# Altium project A5000_8MB.PrjPcb
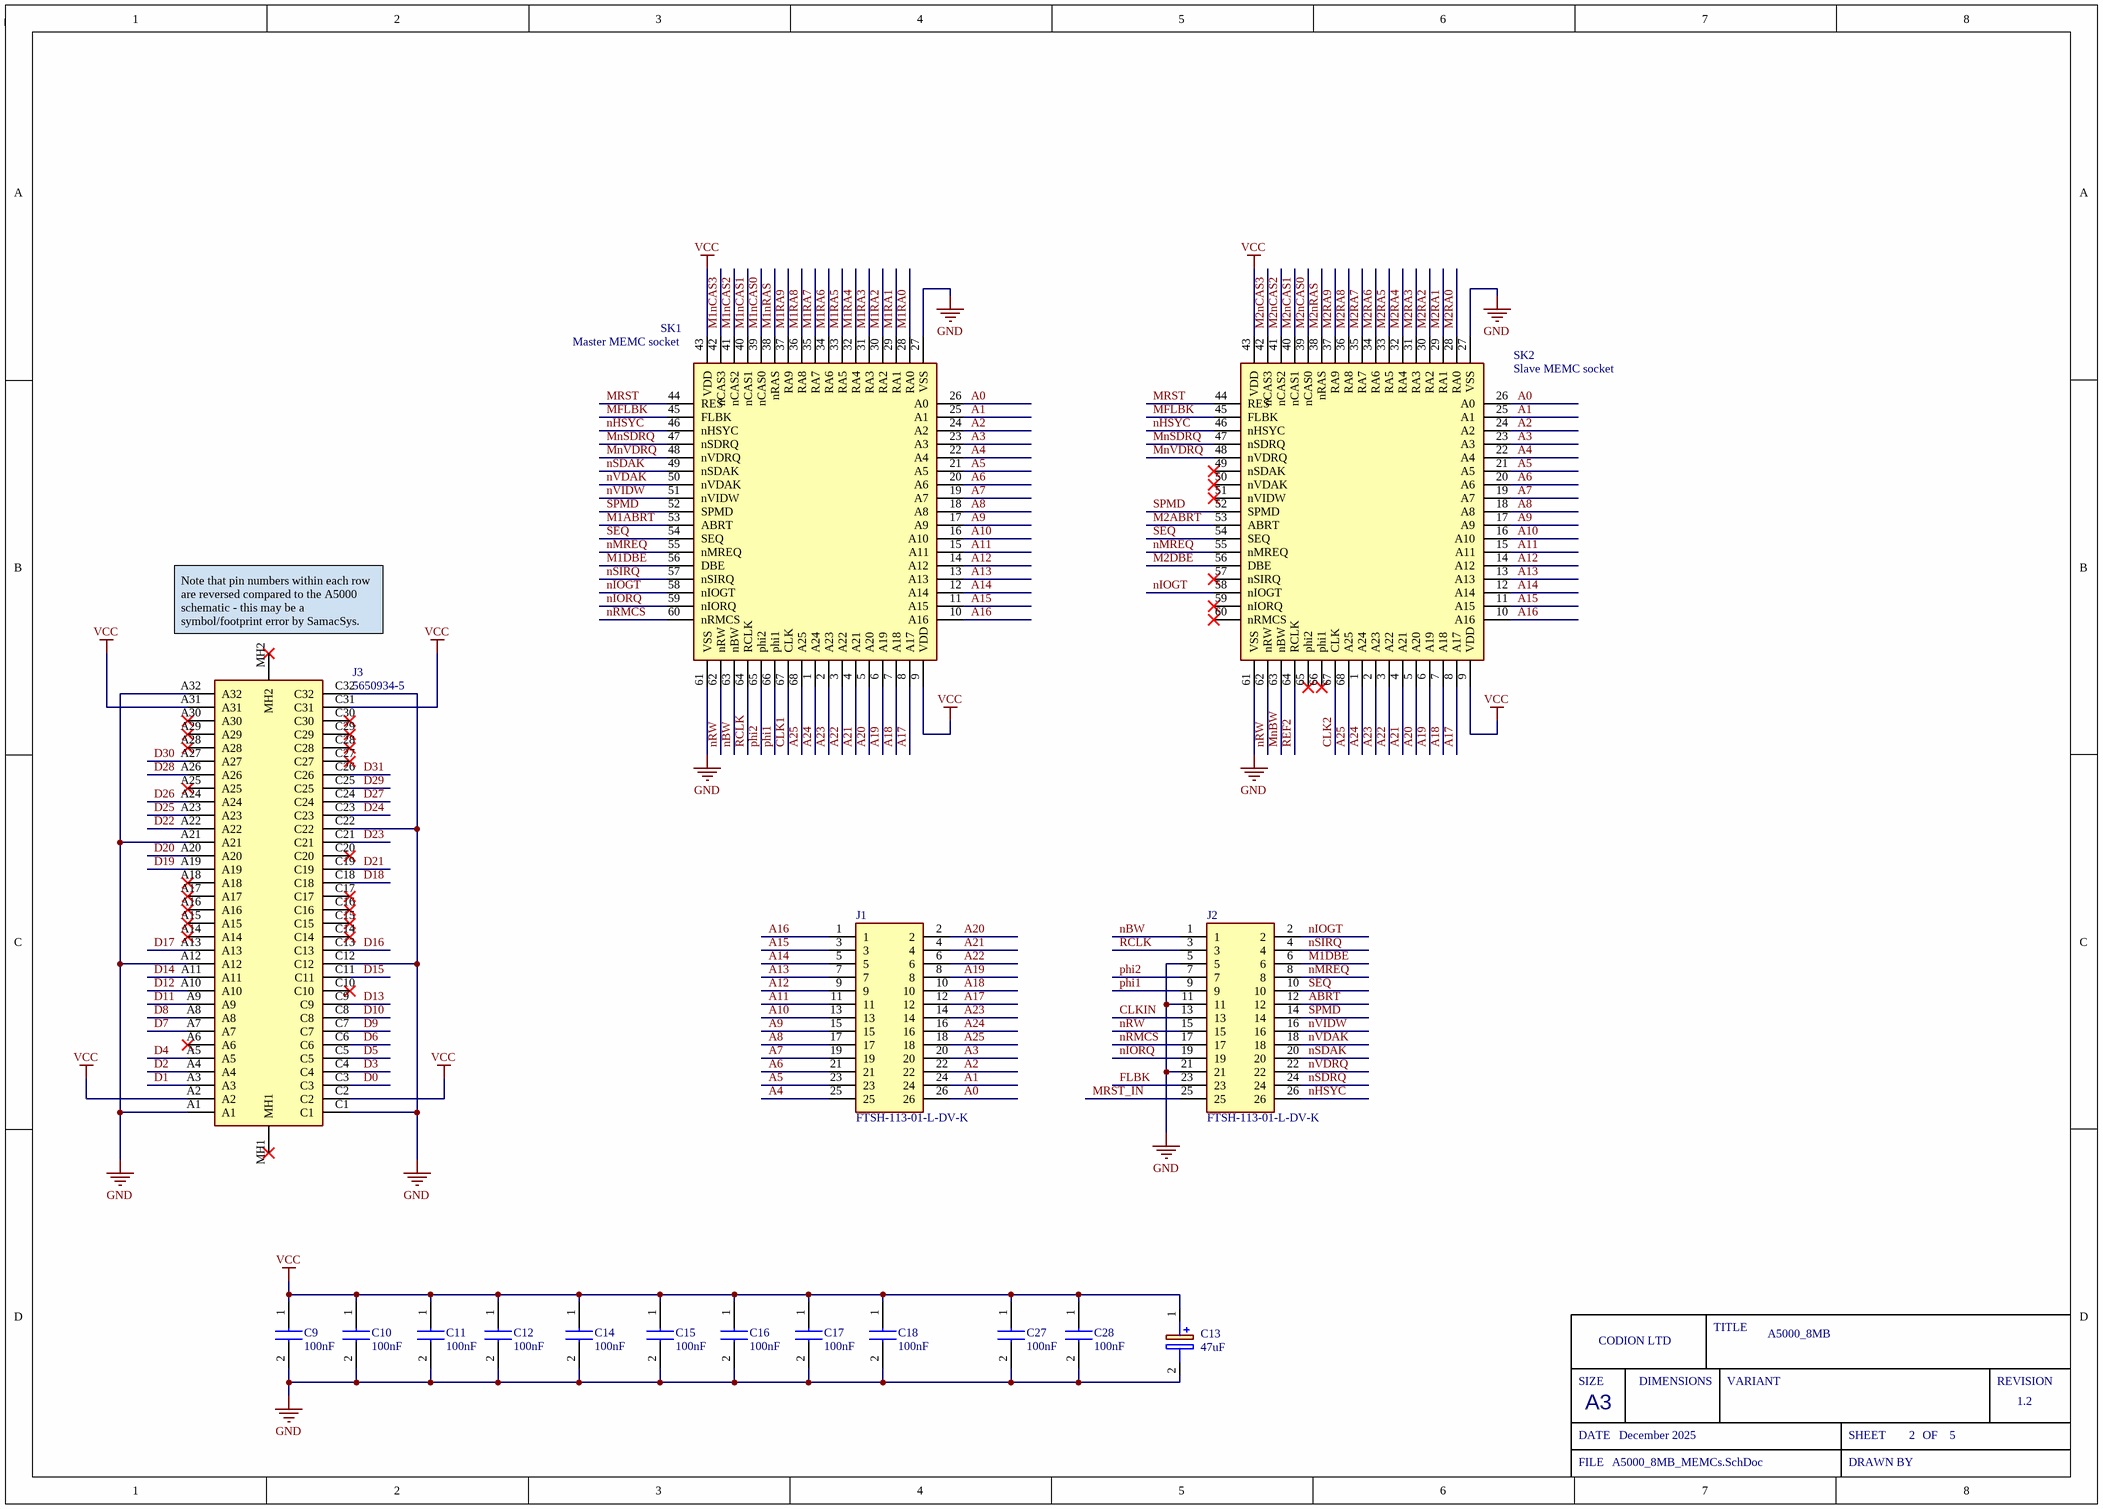
[diagram p0: A5000_8MB_MEMCs.SchDoc]
Sch_RevNo: 1.2; Sch_releaseDate: December 2025; Project_Title: A5000_8MB; ProjectName: A5000_8MB; PCB_RevNo: 1.2; Engineer_Name: Codion Ltd; BOM_RevNo: 1.2
3 sheets, 71 parts. Net scope: global (net labels, ports and power ports of the same name join across sheets).
Board file: A5000_8MB.pcbdoc
Sheets:
  A5000_8MB_MEMCs.SchDoc
  A5000_8MB_Glue.SchDoc
  A5000_8MB_RAMs.SchDoc

## Sheet A5000_8MB_MEMCs.SchDoc: ARM2 to ARM3 Adapter
size A3; DocumentNumber: 1; SheetNumber: 2; SheetTotal: 5

### Parts
C9  100nF  [0805cap]
C10  100nF  [0805cap]
C11  100nF  [0805cap]
C12  100nF  [0805cap]
C13  47uF  [EEE1AA101SP]
C14  100nF  [0805cap]
C15  100nF  [0805cap]
C16  100nF  [0805cap]
C17  100nF  [0805cap]
C18  100nF  [0805cap]
C27  100nF  [0805cap]
C28  100nF  [0805cap]
J1  FTSH-113-01-L-DV-K  [FTSH-113-XX-YYY-DV-K]
J2  FTSH-113-01-L-DV-K  [FTSH-113-XX-YYY-DV-K]
J3  5650934-5  [56509345]
SK1  Master MEMC socket  [MEMC_Socket]
SK2  Slave MEMC socket  [MEMC_Socket]

### Nets
GND: C9.2 C10.2 C11.2 C12.2 C13.2(-) C14.2 C15.2 C16.2 C17.2 C18.2 C27.2 C28.2 J2.5 J2.11 J2.21 J3.A1 J3.A12 J3.A21 J3.A32 J3.C1 J3.C12 J3.C22 J3.C32 SK1.27(VSS) SK1.61(VSS) SK2.27(VSS) SK2.61(VSS)
VCC: C9.1 C10.1 C11.1 C12.1 C13.1(+) C14.1 C15.1 C16.1 C17.1 C18.1 C27.1 C28.1 J3.A2 J3.A31 J3.C2 J3.C31 SK1.9(VDD) SK1.43(VDD) SK2.9(VDD) SK2.43(VDD)
A0: J1.26 SK1.26(A0) SK2.26(A0)
A1: J1.24 SK1.25(A1) SK2.25(A1)
A2: J1.22 SK1.24(A2) SK2.24(A2)
A3: J1.20 SK1.23(A3) SK2.23(A3)
A4: J1.25 SK1.22(A4) SK2.22(A4)
A5: J1.23 SK1.21(A5) SK2.21(A5)
A6: J1.21 SK1.20(A6) SK2.20(A6)
A7: J1.19 SK1.19(A7) SK2.19(A7)
A8: J1.17 SK1.18(A8) SK2.18(A8)
A9: J1.15 SK1.17(A9) SK2.17(A9)
A10: J1.13 SK1.16(A10) SK2.16(A10)
A11: J1.11 SK1.15(A11) SK2.15(A11)
A12: J1.9 SK1.14(A12) SK2.14(A12)
A13: J1.7 SK1.13(A13) SK2.13(A13)
A14: J1.5 SK1.12(A14) SK2.12(A14)
A15: J1.3 SK1.11(A15) SK2.11(A15)
A16: J1.1 SK1.10(A16) SK2.10(A16)
A17: J1.12 SK1.8(A17) SK2.8(A17)
A18: J1.10 SK1.7(A18) SK2.7(A18)
A19: J1.8 SK1.6(A19) SK2.6(A19)
A20: J1.2 SK1.5(A20) SK2.5(A20)
A21: J1.4 SK1.4(A21) SK2.4(A21)
A22: J1.6 SK1.3(A22) SK2.3(A22)
A23: J1.14 SK1.2(A23) SK2.2(A23)
A24: J1.16 SK1.1(A24) SK2.1(A24)
A25: J1.18 SK1.68(A25) SK2.68(A25)
ABRT: J2.12
CLK1: SK1.67(CLK)
CLK2: SK2.67(CLK)
CLKIN: J2.13
D0: J3.C3
D1: J3.A3
D2: J3.A4
D3: J3.C4
D4: J3.A5
D5: J3.C5
D6: J3.C6
D7: J3.A7
D8: J3.A8
D9: J3.C7
D10: J3.C8
D11: J3.A9
D12: J3.A10
D13: J3.C9
D14: J3.A11
D15: J3.C11
D16: J3.C13
D17: J3.A13
D18: J3.C18
D19: J3.A19
D20: J3.A20
D21: J3.C19
D22: J3.A22
D23: J3.C21
D24: J3.C23
D25: J3.A23
D26: J3.A24
D27: J3.C24
D28: J3.A26
D29: J3.C25
D30: J3.A27
D31: J3.C26
FLBK: J2.23
M1ABRT: SK1.53(ABRT)
M1DBE: J2.6 SK1.56(DBE)
M1nCAS0: SK1.39(nCAS0)
M1nCAS1: SK1.40(nCAS1)
M1nCAS2: SK1.41(nCAS2)
M1nCAS3: SK1.42(nCAS3)
M1nRAS: SK1.38(nRAS)
M1RA0: SK1.28(RA0)
M1RA1: SK1.29(RA1)
M1RA2: SK1.30(RA2)
M1RA3: SK1.31(RA3)
M1RA4: SK1.32(RA4)
M1RA5: SK1.33(RA5)
M1RA6: SK1.34(RA6)
M1RA7: SK1.35(RA7)
M1RA8: SK1.36(RA8)
M1RA9: SK1.37(RA9)
M2ABRT: SK2.53(ABRT)
M2DBE: SK2.56(DBE)
M2nCAS0: SK2.39(nCAS0)
M2nCAS1: SK2.40(nCAS1)
M2nCAS2: SK2.41(nCAS2)
M2nCAS3: SK2.42(nCAS3)
M2nRAS: SK2.38(nRAS)
M2RA0: SK2.28(RA0)
M2RA1: SK2.29(RA1)
M2RA2: SK2.30(RA2)
M2RA3: SK2.31(RA3)
M2RA4: SK2.32(RA4)
M2RA5: SK2.33(RA5)
M2RA6: SK2.34(RA6)
M2RA7: SK2.35(RA7)
M2RA8: SK2.36(RA8)
M2RA9: SK2.37(RA9)
MFLBK: SK1.45(FLBK) SK2.45(FLBK)
MnBW: SK2.63(nBW)
MnSDRQ: SK1.47(nSDRQ) SK2.47(nSDRQ)
MnVDRQ: SK1.48(nVDRQ) SK2.48(nVDRQ)
MRST: SK1.44(RES) SK2.44(RES)
MRST_IN: J2.25
nBW: J2.1 SK1.63(nBW)
nHSYC: J2.26 SK1.46(nHSYC) SK2.46(nHSYC)
nIOGT: J2.2 SK1.58(nIOGT) SK2.58(nIOGT)
nIORQ: J2.19 SK1.59(nIORQ)
nMREQ: J2.8 SK1.55(nMREQ) SK2.55(nMREQ)
nRMCS: J2.17 SK1.60(nRMCS)
nRW: J2.15 SK1.62(nRW) SK2.62(nRW)
nSDAK: J2.20 SK1.49(nSDAK)
nSDRQ: J2.24
nSIRQ: J2.4 SK1.57(nSIRQ)
nVDAK: J2.18 SK1.50(nVDAK)
nVDRQ: J2.22
nVIDW: J2.16 SK1.51(nVIDW)
phi1: J2.9 SK1.66(phi1)
phi2: J2.7 SK1.65(phi2)
RCLK: J2.3 SK1.64(RCLK)
REF2: SK2.64(RCLK)
SEQ: J2.10 SK1.54(SEQ) SK2.54(SEQ)
SPMD: J2.14 SK1.52(SPMD) SK2.52(SPMD)

Not connected (* = marked no-connect by the designer): J3 A6* A14* A15* A16* A17* A18* A25* A28* A29* A30* C10* C14* C15* C16* C17* C20* C27* C28* C29* C30* MH1* MH2*; SK2 49(nSDAK)* 50(nVDAK)* 51(nVIDW)* 57(nSIRQ)* 59(nIORQ)* 60(nRMCS)* 65(phi2)* 66(phi1)*

### Notes on the sheet
- (near J3) Note that pin numbers within each row are reversed compared to the A5000 schematic - this may be a symbol/footprint error by SamacSys.
- SIZE
- CODION LTD
- DIMENSIONS
- TITLE
- VARIANT
- REVISION
- DATE
- A3
- SHEET
- OF
- FILE
- DRAWN BY

### Library data of the parts
C9-C12 C14-C18 C27 C28 = 100nF0805: Capacitor; Manufacturer_Name: TDK; Manufacturer_Part_Number: C2012X7R1H104K125AM; Datasheet Link: https://product.tdk.com/info/en/catalog/datasheets/mlcc_commercial_midvoltage_en.pdf; Height: 1.45mm; Mouser Part Number: 810-C2012X7R1H104KT5; Mouser Price/Stock: https://www.mouser.com/Search/Refine.aspx?Keyword=810-C2012X7R1H104KT5; Arrow Part Number: C2012X7R1H104K125AM; Arrow Price/Stock: https://www.arrow.com/en/products/c2012x7r1h104k125am/tdk; LCSC Part #: C111492
C13 = EEE1VA470WP: Capacitor Polarised; Manufacturer_Name: Panasonic; Datasheet Link: http://industrial.panasonic.com/cdbs/www-data/pdf/RDE0000/ABA0000C1145.pdf; Height: 7.8mm; Manufacturer_Part_Number: EEE1VA470WP
J1 J2 = FTSH-113-01-L-DV-K: Connector; Manufacturer_Name: SAMTEC; Datasheet Link: http://suddendocs.samtec.com/prints/ftsh-1xx-xx-xxx-dv-xxx-xxx-mkt.pdf; Manufacturer_Part_Number: FTSH-113-01-L-DV-K; Mouser Part Number: 200-FTSH11301LDVK; Mouser Price/Stock: https://www.mouser.co.uk/ProductDetail/Samtec/FTSH-113-01-L-DV-K?qs=iT52DjcXudtZOdiFTGniSQ%3D%3D; Arrow Part Number: FTSH-113-01-L-DV-K; Arrow Price/Stock: https://www.arrow.com/en/products/ftsh-113-01-l-dv-k/samtec
J3 = 5650934-5: Connector; Manufacturer_Name: TE Connectivity; Datasheet Link: https://datasheet.datasheetarchive.com/originals/distributors/Datasheets_SAMA/9abbe19037fbf7301e49f31c79c0c77d.pdf; Height: 11.51mm; Manufacturer_Part_Number: 5650934-5; Mouser Part Number: 571-5650934-5; Mouser Price/Stock: https://www.mouser.co.uk/ProductDetail/TE-Connectivity/5650934-5?qs=DpCaYn0bdggz0Lybp365wg%3D%3D; Arrow Part Number: 5650934-5; Arrow Price/Stock: https://www.arrow.com/en/products/5650934-5/te-connectivity
SK1 SK2 = MEMC_Skt: MEMC socket; Manufacturer_Name: 3M; Manufacturer_Part_Number: 8468-21B1-RK-TR; Datasheet Link: https://www.arrow.com/en/products/8468-21b1-rk-tr/3m; Height: 4.6mm; Mouser Part Number: 517-8468-21B1-RK-TR; Mouser Price/Stock: https://www.mouser.co.uk/ProductDetail/3M-Electronic-Solutions-Division/8468-21B1-RK-TR?qs=X%2F%2F06fXhnJ18zOj3KK47CQ%3D%3D; Arrow Part Number: 8468-21B1-RK-TR; Arrow Price/Stock: https://www.arrow.com/en/products/8468-21b1-rk-tr/3m

## Sheet A5000_8MB_Glue.SchDoc
size A3; DocumentNumber: 1; SheetNumber: 1; SheetTotal: 5
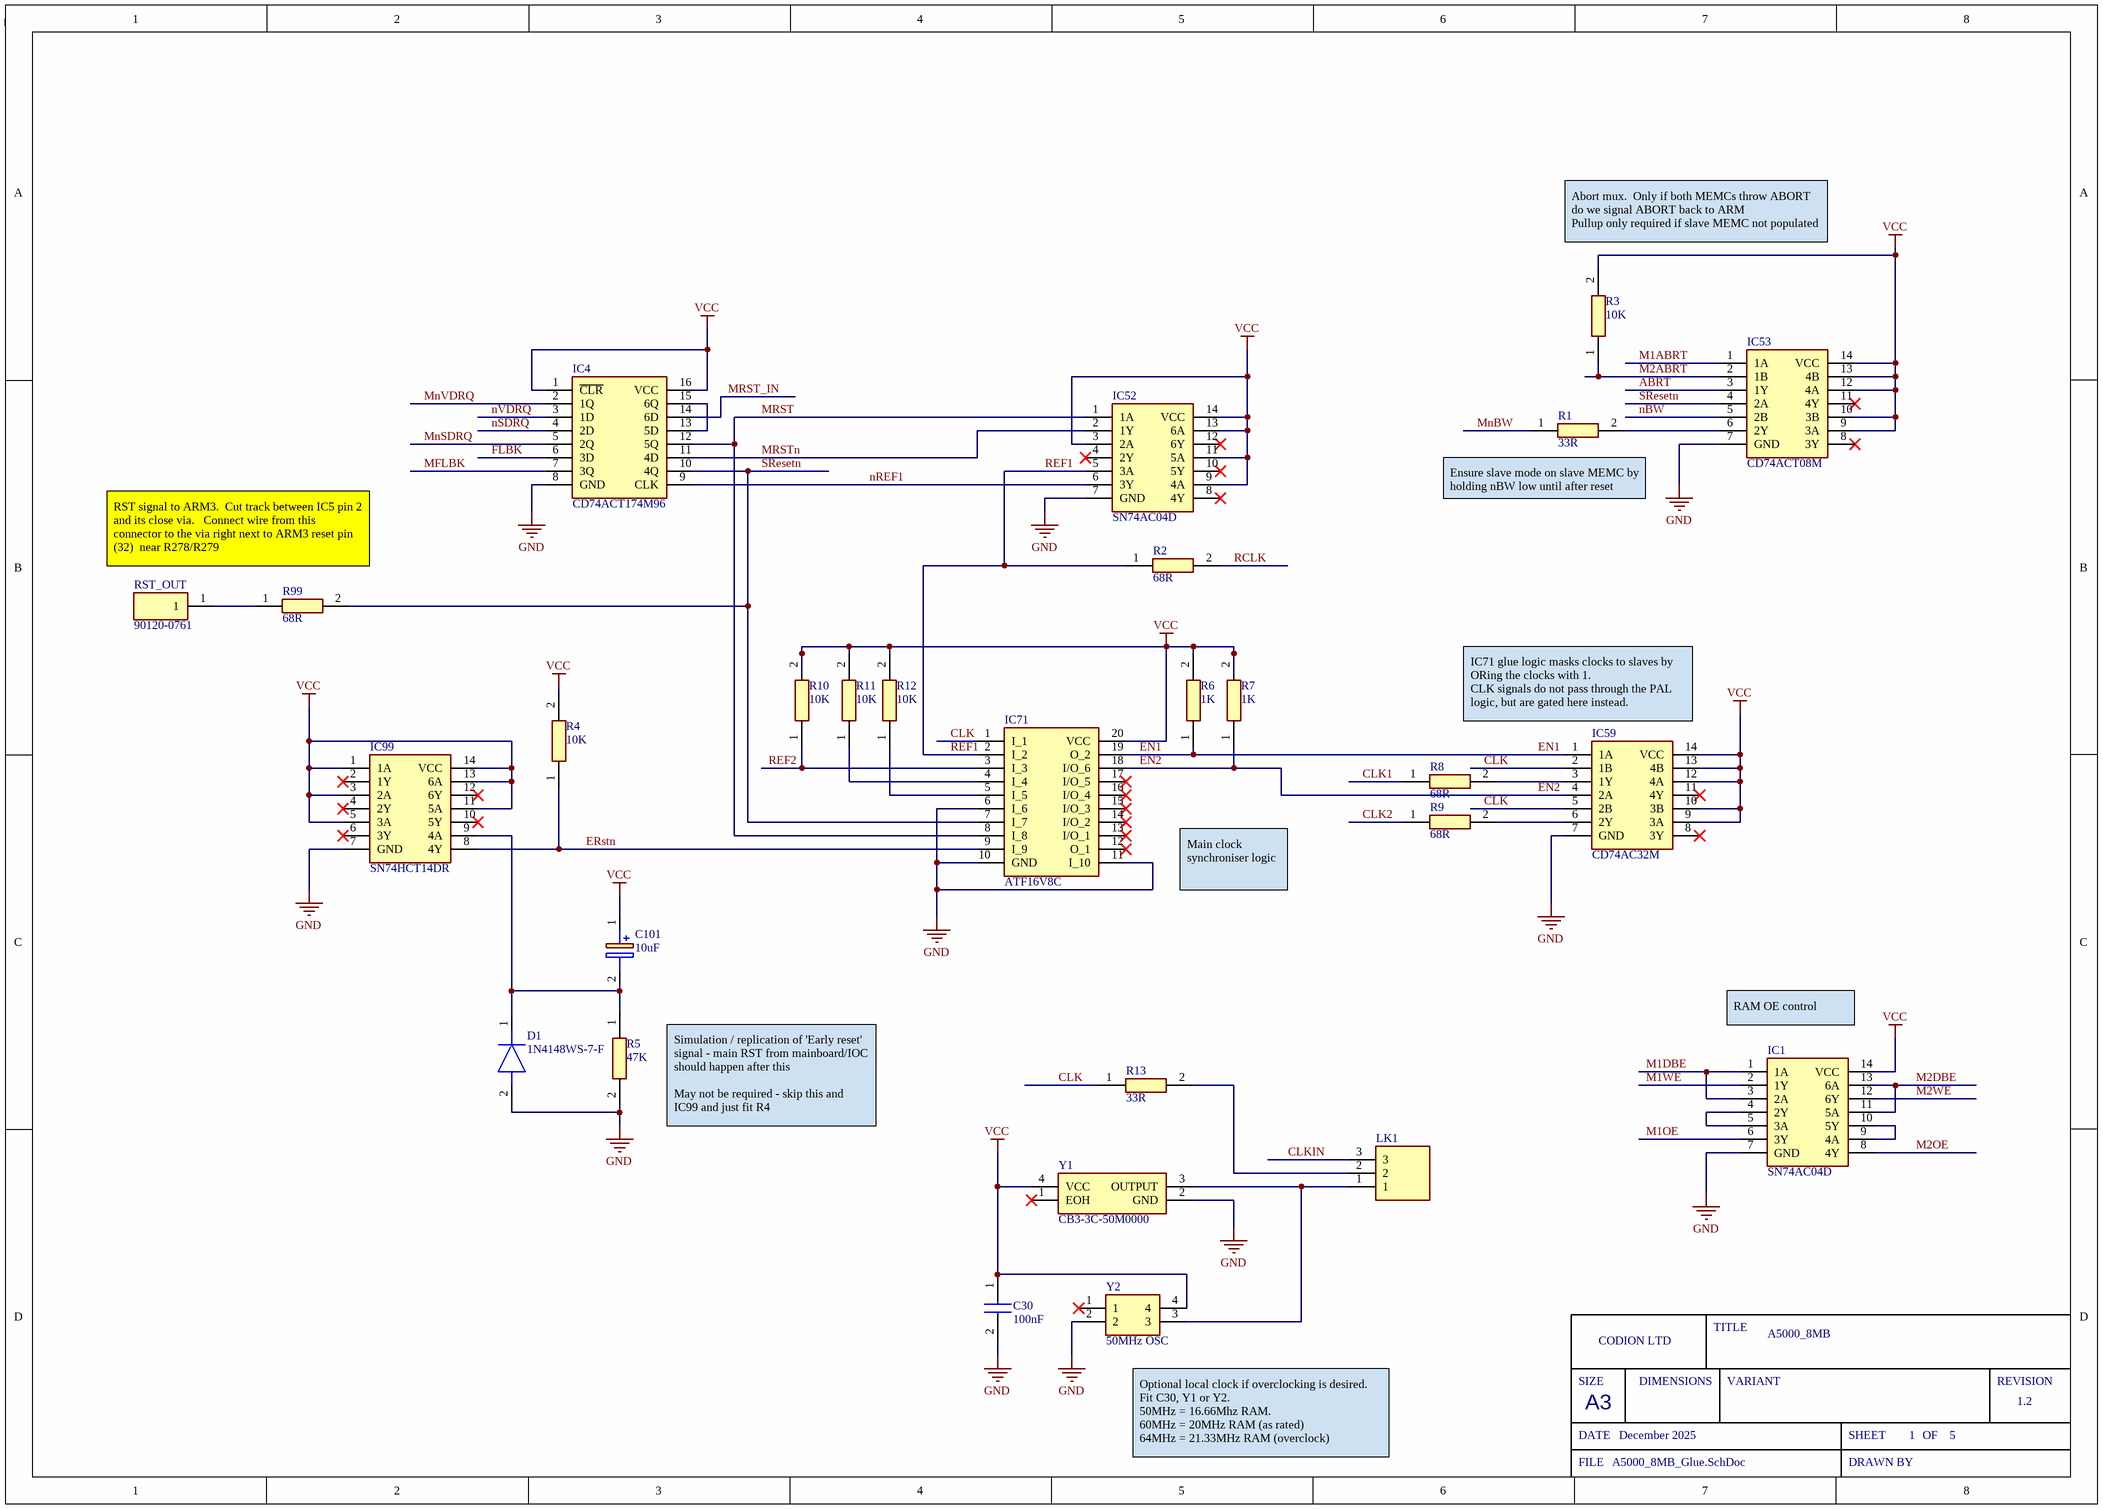
[diagram p1: A5000_8MB_Glue.SchDoc]

### Parts
C30  100nF  [0805cap]
C101  10uF  [EEE0GA101SR]
D1  1N4148WS-7-F  [SOD2513X120N]
IC1  SN74AC04D  [SOIC127P600X175-14N]
IC4  CD74ACT174M96  [SOIC127P600X175-16N]
IC52  SN74AC04D  [SOIC127P600X175-14N]
IC53  CD74ACT08M  [SOIC127P600X175-14N]
IC59  CD74AC32M  [SOIC127P600X175-14N]
IC71  ATF16V8C  [DIP762W66P254L2692H508Q20N]
IC99  SN74HCT14DR  [SOIC127P600X175-14N]
LK1  PREC003SAAN-RC  [HDRV3W64P0X254_1X3_762X254X868P]  (value not drawn)
R1  33R  [RESC1005X40N]
R2  68R  [RESC1005X40N]
R3  10K  [RESC1005X40N]
R4  10K  [RESC1005X40N]
R5  47K  [RESC1005X40N]
R6  1K  [RESC1005X40N]
R7  1K  [RESC1005X40N]
R8  68R  [RESC1005X40N]
R9  68R  [RESC1005X40N]
R10  10K  [RESC1005X40N]
R11  10K  [RESC1005X40N]
R12  10K  [RESC1005X40N]
R13  33R  [RESC1005X40N]
R99  68R  [RESC1005X40N]
RST_OUT  90120-0761  [HDRV1W90P0X254_1X1_232X249X560P]
Y1  CB3-3C-50M0000  [CB33C50M0000]
Y2  50MHz OSC  [DIPS762W56P1524L1778H241Q4N]

### Nets
GND: C30.2 D1.2(A) IC1.7(GND) IC4.8(GND) IC52.7(GND) IC53.7(GND) IC59.7(GND) IC71.6(I_6) IC71.10(GND) IC71.11(I_10) IC99.7(GND) R5.2 Y1.2(GND) Y2.2
VCC: C30.1 C101.1(+) IC1.14(VCC) IC4.1(~{CLR}) IC4.16(VCC) IC52.3(2A) IC52.9(4A) IC52.11(5A) IC52.13(6A) IC52.14(VCC) IC53.9(3A) IC53.10(3B) IC53.12(4A) IC53.13(4B) IC53.14(VCC) IC59.9(3A) IC59.10(3B) IC59.12(4A) IC59.13(4B) IC59.14(VCC) IC71.20(VCC) IC99.1(1A) IC99.3(2A) IC99.5(3A) IC99.11(5A) IC99.13(6A) IC99.14(VCC) R3.2 R4.2 R6.2 R7.2 R10.2 R11.2 R12.2 Y1.4(VCC) Y2.4
ABRT: IC53.3(1Y)
CLK: IC59.2(1B) IC59.5(2B) IC71.1(I_1) R13.1
CLK1: R8.1
CLK2: R9.1
CLKIN: LK1.3
EN1: IC59.1(1A) IC71.19(O_2) R6.1
EN2: IC59.4(2A) IC71.18(I/O_6) R7.1
ERstn: IC71.9(I_9) IC99.8(4Y) R4.1
FLBK: IC4.6(3D)
M1ABRT: IC53.1(1A)
M1DBE: IC1.1(1A) IC1.3(2A)
M1OE: IC1.6(3Y)
M1WE: IC1.2(1Y)
M2ABRT: IC53.2(1B) R3.1
M2DBE: IC1.11(5A) IC1.13(6A)
M2OE: IC1.8(4Y)
M2WE: IC1.12(6Y)
MFLBK: IC4.7(3Q)
MnBW: R1.1
MnSDRQ: IC4.5(2Q)
MnVDRQ: IC4.2(1Q)
MRST: IC4.12(5Q) IC52.1(1A) IC71.8(I_8)
MRST_IN: IC4.14(6D)
MRSTn: IC4.11(4D) IC52.2(1Y)
nBW: IC53.5(2B)
nREF1: IC4.9(CLK) IC52.6(3Y)
nSDRQ: IC4.4(2D)
nVDRQ: IC4.3(1D)
RCLK: R2.2
REF1: IC52.5(3A) IC71.2(I_2) R2.1
REF2: IC71.3(I_3) R10.1
SResetn: IC4.10(4Q) IC53.4(2A) IC71.7(I_7) R99.2
NetC101_2: C101.2(-) D1.1(K) IC99.9(4A) R5.1
NetIC1_4: IC1.4(2Y) IC1.5(3A)
NetIC1_9: IC1.9(4A) IC1.10(5Y)
NetIC4_13: IC4.13(5D) IC4.15(6Q)
NetIC53_6: IC53.6(2Y) R1.2
NetIC59_3: IC59.3(1Y) R8.2
NetIC59_6: IC59.6(2Y) R9.2
NetIC71_4: IC71.4(I_4) R11.1
NetIC71_5: IC71.5(I_5) R12.1
NetLK1_1: LK1.1 Y1.3(OUTPUT) Y2.3
NetLK1_2: LK1.2 R13.2
NetR99_1: R99.1 RST_OUT.1

Not connected (* = marked no-connect by the designer): IC52 4(2Y)* 8(4Y)* 10(5Y)* 12(6Y)*; IC53 8(3Y)* 11(4Y)*; IC59 8(3Y)* 11(4Y)*; IC71 12(O_1)* 13(I/O_1)* 14(I/O_2)* 15(I/O_3)* 16(I/O_4)* 17(I/O_5)*; IC99 2(1Y)* 4(2Y)* 6(3Y)* 10(5Y)* 12(6Y)*; Y1 1(EOH)*; Y2 1*

### Notes on the sheet
- Abort mux.  Only if both MEMCs throw ABORT do we signal ABORT back to ARM
  Pullup only required if slave MEMC not populated
- (near R1) Ensure slave mode on slave MEMC by holding nBW low until after reset
- RST signal to ARM3.  Cut track between IC5 pin 2 and its close via.   Connect wire from this connector to the via right next to ARM3 reset pin (32)  near R278/R279
- (near IC59) IC71 glue logic masks clocks to slaves by ORing the clocks with 1.
  CLK signals do not pass through the PAL logic, but are gated here instead.
- Main clock synchroniser logic
- (near IC1) RAM OE control
- Simulation / replication of 'Early reset' signal - main RST from mainboard/IOC should happen after this
  May not be required - skip this and IC99 and just fit R4
- (near Y2) Optional local clock if overclocking is desired.
  Fit C30, Y1 or Y2.
  50MHz = 16.66Mhz RAM.
  60MHz = 20MHz RAM (as rated)
  64MHz = 21.33MHz RAM (overclock)
- SIZE
- CODION LTD
- DIMENSIONS
- TITLE
- VARIANT
- REVISION
- DATE
- A3
- SHEET
- OF
- FILE
- DRAWN BY

### Library data of the parts
C30 = 100nF0805: as C9 on sheet A5000_8MB_MEMCs; Datasheet Link: https://product.tdk.com/info/en/catalog/datasheets/mlcc_commercial_midvoltage_en.pdf; Height: 1.45mm; Mouser Part Number: 810-C2012X7R1H104KT5; Mouser Price/Stock: https://www.mouser.com/Search/Refine.aspx?Keyword=810-C2012X7R1H104KT5; Arrow Part Number: C2012X7R1H104K125AM; Arrow Price/Stock: https://www.arrow.com/en/products/c2012x7r1h104k125am/tdk; LCSC Part #: C111492
C101 = EEE-1EA100SR: Capacitor Polarised; Manufacturer_Name: Panasonic; Datasheet Link: http://industrial.panasonic.com/cdbs/www-data/pdf/RDE0000/ABA0000C1145.pdf; Height: 6.5mm; Manufacturer_Part_Number: EEE-1EA100SR; Mouser Part Number: 667-EEE-1EA100SR; Mouser Price/Stock: https://www.mouser.co.uk/ProductDetail/Panasonic/EEE-1EA100SR?qs=ANJC8C65Mw4%2Fvo1GoepKcQ%3D%3D; Arrow Part Number: EEE-1EA100SR; Arrow Price/Stock: https://www.arrow.com/en/products/eee-1ea100sr/panasonic?region=nac
D1 = 1N4148WS-7-F: Diode; Manufacturer_Name: Diodes Inc.; Datasheet Link: https://componentsearchengine.com/Datasheets/2/1N4148WS-7-F.pdf; Height: 1.2mm; Manufacturer_Part_Number: 1N4148WS-7-F; Mouser Part Number: 621-1N4148WS-F; Mouser Price/Stock: https://www.mouser.co.uk/ProductDetail/Diodes-Incorporated/1N4148WS-7-F?qs=4drIV0IxA0r8aNy7%2Fu4kVw%3D%3D; Arrow Part Number: 1N4148WS-7-F; Arrow Price/Stock: https://www.arrow.com/en/products/1n4148ws-7-f/diodes-incorporated?region=asia; LCSC Part #: C2128
IC1 IC52 = SN74AC04D: Integrated Circuit; Manufacturer_Name: Texas Instruments; Datasheet Link: http://www.ti.com/lit/ds/symlink/sn74ac04.pdf; Height: 1.75mm; Manufacturer_Part_Number: SN74AC04D; Mouser Part Number: 595-SN74AC04D; Mouser Price/Stock: https://www.mouser.co.uk/ProductDetail/Texas-Instruments/SN74AC04D?qs=w32V8uFkMxkvsyMHHacuZw%3D%3D; Arrow Part Number: SN74AC04D; Arrow Price/Stock: https://www.arrow.com/en/products/sn74ac04d/texas-instruments?region=nac; LCSC Part #: C352940
IC4 = CD74ACT174M96: Integrated Circuit; Manufacturer_Name: Texas Instruments; Datasheet Link: http://www.ti.com/lit/gpn/cd74act174; Height: 1.75mm; Manufacturer_Part_Number: CD74ACT174M96; Mouser Part Number: 595-CD74ACT174M96; Mouser Price/Stock: https://www.mouser.co.uk/ProductDetail/Texas-Instruments/CD74ACT174M96?qs=w32V8uFkMxkDXs1ka6HDkg%3D%3D
IC53 = CD74ACT08M: Integrated Circuit; Manufacturer_Name: Texas Instruments; Datasheet Link: http://www.ti.com/lit/ds/symlink/cd74act08.pdf; Height: 1.75mm; Manufacturer_Part_Number: CD74ACT08M; Mouser Part Number: 595-CD74ACT08M; Mouser Price/Stock: https://www.mouser.co.uk/ProductDetail/Texas-Instruments/CD74ACT08M?qs=Dqy2GfToSoQdsNWXM2phYA%3D%3D; LCSC Part #: C233452
IC59 = CD74AC32M: Integrated Circuit; Manufacturer_Name: Texas Instruments; Datasheet Link: http://www.ti.com/lit/ds/symlink/cd74ac32.pdf; Height: 1.75mm; Manufacturer_Part_Number: CD74AC32M; Mouser Part Number: 595-CD74AC32M; Mouser Price/Stock: https://www.mouser.co.uk/ProductDetail/Texas-Instruments/CD74AC32M?qs=OorDGPQ79Eqsy7tzrsTtUg%3D%3D; Arrow Part Number: CD74AC32M; Arrow Price/Stock: https://www.arrow.com/en/products/cd74ac32m/texas-instruments; LCSC Part #: C352943
IC71 = PAL16R4AMJ: Integrated Circuit; Manufacturer_Name: Texas Instruments; Datasheet Link: http://www.ti.com/lit/ds/symlink/pal16r4am.pdf; Height: 5.08mm; Manufacturer_Part_Number: PAL16R4AMJ; Mouser Part Number: 595-PAL16R4AMJ; Mouser Price/Stock: https://www.mouser.com/Search/Refine.aspx?Keyword=595-PAL16R4AMJ
IC99 = SN74HCT14DR: Integrated Circuit; Manufacturer_Name: Texas Instruments; Datasheet Link: http://www.ti.com/lit/ds/symlink/sn74hct14.pdf; Height: 1.75mm; Manufacturer_Part_Number: SN74HCT14DR; Mouser Part Number: 595-SN74HCT14DR; Mouser Price/Stock: https://www.mouser.co.uk/ProductDetail/Texas-Instruments/SN74HCT14DR?qs=SL3LIuy2dWxogEVGE105Iw%3D%3D; Arrow Part Number: SN74HCT14DR; Arrow Price/Stock: https://www.arrow.com/en/products/sn74hct14dr/texas-instruments?region=nac; LCSC Part #: C6769
LK1 = PREC003SAAN-RC: Connector; Manufacturer_Name: Sullins; Datasheet Link: https://media.digikey.com/PDF/Data%20Sheets/Sullins%20PDFs/z%20RzCzzzSzzN-RC,%20ST,11635-B.pdf; Height: 8.68mm; Manufacturer_Part_Number: PREC003SAAN-RC
R1 R13 = CRCW040233R0FKED: Resistor; Manufacturer_Name: Vishay; Datasheet Link: http://www.vishay.com/docs/20035/dcrcwe3.pdf; Height: 0.4mm; Manufacturer_Part_Number: CRCW040233R0FKED; Mouser Part Number: 71-CRCW0402-33-E3; Mouser Price/Stock: https://www.mouser.co.uk/ProductDetail/Vishay-Dale/CRCW040233R0FKED?qs=TNtMkGKFKOyo77UGFlXIJw%3D%3D; Arrow Part Number: CRCW040233R0FKED; Arrow Price/Stock: https://www.arrow.com/en/products/crcw040233r0fked/vishay; LCSC Part #: C137880
R2 R8 R9 R99 = CRCW040268R0FKEDHP: Resistor; Manufacturer_Name: Vishay; Datasheet Link: http://www.vishay.com/docs/20035/dcrcwe3.pdf; Height: 0.4mm; Manufacturer_Part_Number: CRCW040268R0FKEDHP; Mouser Part Number: 71-CRCW040268R0FKEDH; Mouser Price/Stock: https://www.mouser.co.uk/ProductDetail/Vishay-Dale/CRCW040268R0FKEDHP?qs=YaA%252B3EhhSt26vU44iyW%252BOw%3D%3D; Arrow Part Number: CRCW040268R0FKEDHP; Arrow Price/Stock: https://www.arrow.com/en/products/crcw040268r0fkedhp/vishay; LCSC Part #: C163455
R3 R4 R10-R12 = CRCW040210K0FKEDHP: Resistor; Manufacturer_Name: Vishay; Datasheet Link: http://www.vishay.com/docs/20035/dcrcwe3.pdf; Height: 0.4mm; Manufacturer_Part_Number: CRCW040210K0FKEDHP; Mouser Part Number: 71-CRCW040210K0FKEDH; Mouser Price/Stock: https://www.mouser.co.uk/ProductDetail/Vishay-Dale/CRCW040210K0FKEDHP?qs=FlFvgi4rxBxmIiaeyFjrkA%3D%3D; Arrow Part Number: CRCW040210K0FKEDHP; Arrow Price/Stock: https://www.arrow.com/en/products/crcw040210k0fkedhp/vishay?region=nac; LCSC Part #: C71617
R5 = CRCW040247K0FKED: Resistor; Manufacturer_Name: Vishay; Datasheet Link: http://www.vishay.com/docs/20035/dcrcwe3.pdf; Height: 0.4mm; Manufacturer_Part_Number: CRCW040247K0FKED; Mouser Part Number: 71-CRCW0402-47K-E3; Mouser Price/Stock: https://www.mouser.co.uk/ProductDetail/Vishay-Dale/CRCW040247K0FKED?qs=rzhQWu8UUS0SPbmGf0DOIg%3D%3D; Arrow Part Number: CRCW040247K0FKED; Arrow Price/Stock: https://www.arrow.com/en/products/crcw040247k0fked/vishay; LCSC Part #: C163440
R6 R7 = CRCW04021K00JNED: Resistor; Manufacturer_Name: Vishay; Datasheet Link: http://www.vishay.com/docs/20035/dcrcwe3.pdf; Height: 0.4mm; Manufacturer_Part_Number: CRCW04021K00JNED; Mouser Part Number: 71-CRCW0402J-1.0K-E3; Mouser Price/Stock: https://www.mouser.co.uk/ProductDetail/Vishay-Dale/CRCW04021K00JNED?qs=YX%252BK5oaHNYpGRsHVuzxl1A%3D%3D; Arrow Part Number: CRCW04021K00JNED; Arrow Price/Stock: https://www.arrow.com/en/products/crcw04021k00jned/vishay; LCSC Part #: C279981
RST_OUT = 90120-0761: Connector; Manufacturer_Name: Molex; Datasheet Link: https://www.molex.com/pdm_docs/sd/901200761_sd.pdf; Height: 5.6mm; Manufacturer_Part_Number: 90120-0761; Mouser Part Number: 538-90120-0761; Mouser Price/Stock: https://www.mouser.co.uk/ProductDetail/Molex/90120-0761?qs=PvP5v7Eimsn%2F58TpDaAAow%3D%3D
Y1 = CB3-3C-50M0000: Crystal or Oscillator; Manufacturer_Name: CTS; Datasheet Link: https://www.arrow.com/en/products/cb3-3c-50m0000/cts; Height: 1.8mm; Manufacturer_Part_Number: CB3-3C-50M0000; Mouser Part Number: 774-CB3-3C-50M0; Mouser Price/Stock: https://www.mouser.co.uk/ProductDetail/CTS-Electronic-Components/CB3-3C-50M0000/?qs=HL%252BYNjdyZ0t9%2FwogPxCGyA%3D%3D; Arrow Part Number: CB3-3C-50M0000; Arrow Price/Stock: https://www.arrow.com/en/products/cb3-3c-50m0000/cts
Y2 = 1107741: Manufacturer_Name: ARIES; Datasheet Link: http://docs-emea.rs-online.com/webdocs/13f3/0900766b813f3237.pdf; Height: 2.41mm; Manufacturer_Part_Number: 1107741; Mouser Part Number: 535-1107741; Mouser Price/Stock: https://www.mouser.co.uk/ProductDetail/Aries-Electronics/1107741?qs=WZRMhwwaLl%2FApwqojhfzdA%3D%3D

## Sheet A5000_8MB_RAMs.SchDoc: ARM2 to ARM3 Adapter
size A3; DocumentNumber: 1; SheetNumber: 3; SheetTotal: 5
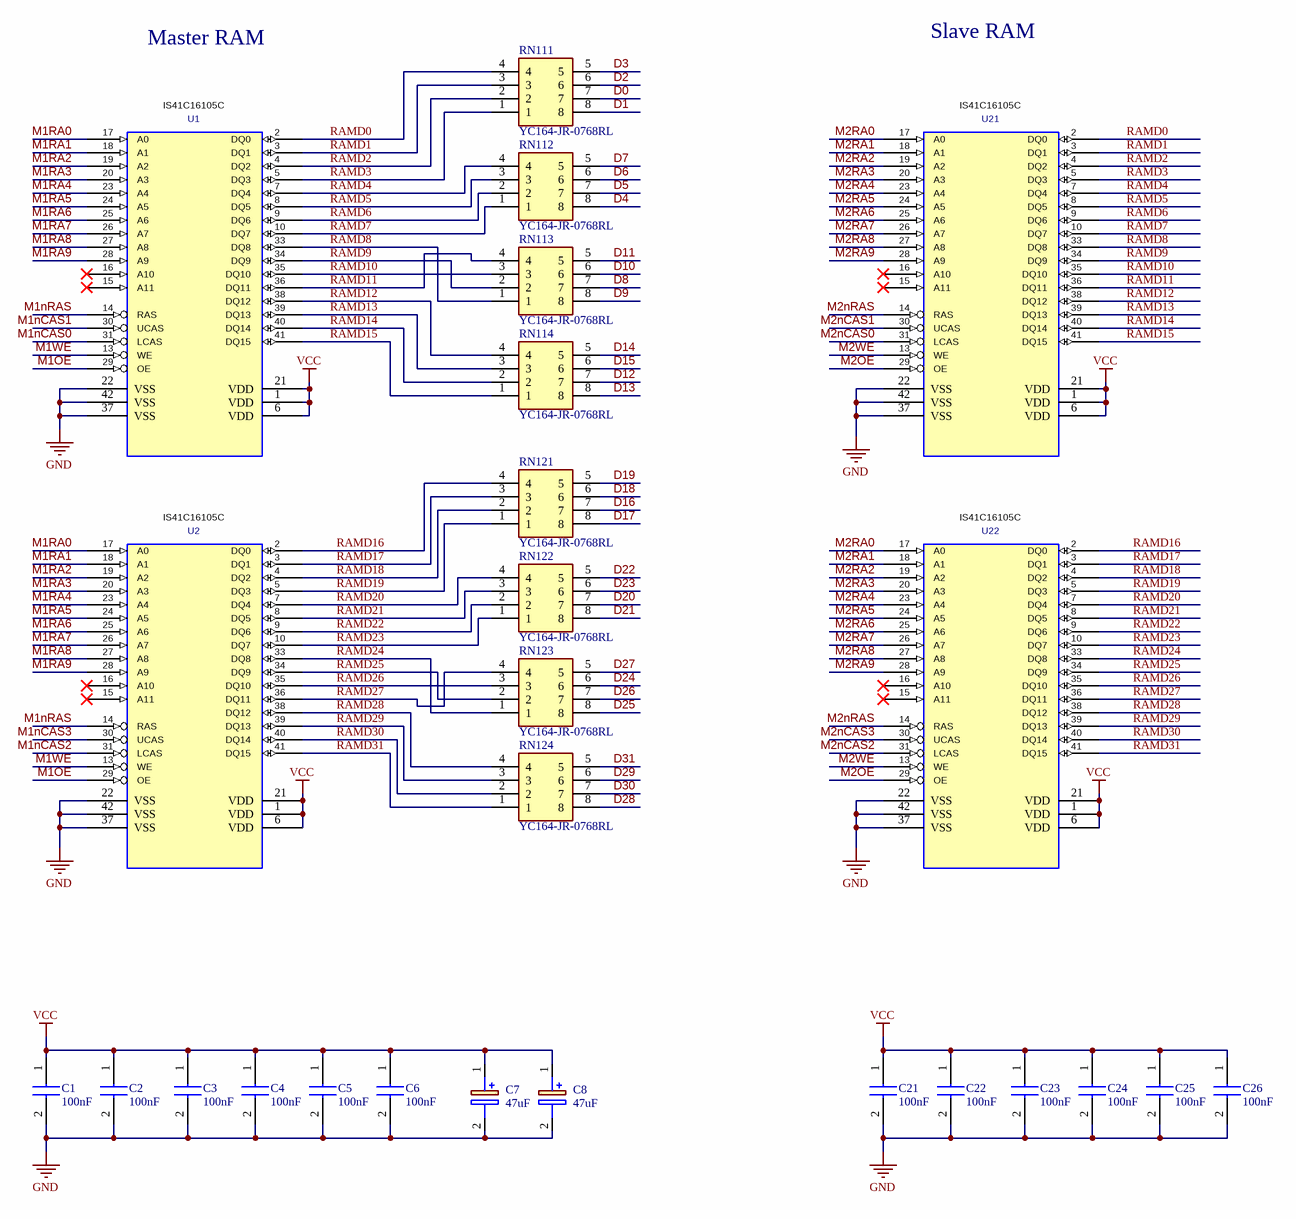
[diagram p2: A5000_8MB_RAMs.SchDoc]

### Parts
C1  100nF  [0805cap]
C2  100nF  [0805cap]
C3  100nF  [0805cap]
C4  100nF  [0805cap]
C5  100nF  [0805cap]
C6  100nF  [0805cap]
C7  47uF  [EEE1AA101SP]
C8  47uF  [EEE1AA101SP]
C21  100nF  [0805cap]
C22  100nF  [0805cap]
C23  100nF  [0805cap]
C24  100nF  [0805cap]
C25  100nF  [0805cap]
C26  100nF  [0805cap]
RN111  YC164-JR-0768RL  [YC164JR0768RL]
RN112  YC164-JR-0768RL  [YC164JR0768RL]
RN113  YC164-JR-0768RL  [YC164JR0768RL]
RN114  YC164-JR-0768RL  [YC164JR0768RL]
RN121  YC164-JR-0768RL  [YC164JR0768RL]
RN122  YC164-JR-0768RL  [YC164JR0768RL]
RN123  YC164-JR-0768RL  [YC164JR0768RL]
RN124  YC164-JR-0768RL  [YC164JR0768RL]
U1  IS41C16105C  [SOJ-42]
U2  IS41C16105C  [SOJ-42]
U21  IS41C16105C  [SOJ-42]
U22  IS41C16105C  [SOJ-42]

### Nets
GND: C1.2 C2.2 C3.2 C4.2 C5.2 C6.2 C7.2(-) C8.2(-) C21.2 C22.2 C23.2 C24.2 C25.2 C26.2 U1.22(VSS) U1.37(VSS) U1.42(VSS) U2.22(VSS) U2.37(VSS) U2.42(VSS) U21.22(VSS) U21.37(VSS) U21.42(VSS) U22.22(VSS) U22.37(VSS) U22.42(VSS)
VCC: C1.1 C2.1 C3.1 C4.1 C5.1 C6.1 C7.1(+) C8.1(+) C21.1 C22.1 C23.1 C24.1 C25.1 C26.1 U1.1(VCC) U1.6(VCC) U1.21(VCC) U2.1(VCC) U2.6(VCC) U2.21(VCC) U21.1(VCC) U21.6(VCC) U21.21(VCC) U22.1(VCC) U22.6(VCC) U22.21(VCC)
D0: RN111.7
D1: RN111.8
D2: RN111.6
D3: RN111.5
D4: RN112.8
D5: RN112.7
D6: RN112.6
D7: RN112.5
D8: RN113.7
D9: RN113.8
D10: RN113.6
D11: RN113.5
D12: RN114.7
D13: RN114.8
D14: RN114.5
D15: RN114.6
D16: RN121.7
D17: RN121.8
D18: RN121.6
D19: RN121.5
D20: RN122.7
D21: RN122.8
D22: RN122.5
D23: RN122.6
D24: RN123.6
D25: RN123.8
D26: RN123.7
D27: RN123.5
D28: RN124.8
D29: RN124.6
D30: RN124.7
D31: RN124.5
M1nCAS0: U1.31(LCAS)
M1nCAS1: U1.30(UCAS)
M1nCAS2: U2.31(LCAS)
M1nCAS3: U2.30(UCAS)
M1nRAS: U1.14(RAS) U2.14(RAS)
M1OE: U1.29(OE) U2.29(OE)
M1RA0: U1.17(A0) U2.17(A0)
M1RA1: U1.18(A1) U2.18(A1)
M1RA2: U1.19(A2) U2.19(A2)
M1RA3: U1.20(A3) U2.20(A3)
M1RA4: U1.23(A4) U2.23(A4)
M1RA5: U1.24(A5) U2.24(A5)
M1RA6: U1.25(A6) U2.25(A6)
M1RA7: U1.26(A7) U2.26(A7)
M1RA8: U1.27(A8) U2.27(A8)
M1RA9: U1.28(A9) U2.28(A9)
M1WE: U1.13(WE) U2.13(WE)
M2nCAS0: U21.31(LCAS)
M2nCAS1: U21.30(UCAS)
M2nCAS2: U22.31(LCAS)
M2nCAS3: U22.30(UCAS)
M2nRAS: U21.14(RAS) U22.14(RAS)
M2OE: U21.29(OE) U22.29(OE)
M2RA0: U21.17(A0) U22.17(A0)
M2RA1: U21.18(A1) U22.18(A1)
M2RA2: U21.19(A2) U22.19(A2)
M2RA3: U21.20(A3) U22.20(A3)
M2RA4: U21.23(A4) U22.23(A4)
M2RA5: U21.24(A5) U22.24(A5)
M2RA6: U21.25(A6) U22.25(A6)
M2RA7: U21.26(A7) U22.26(A7)
M2RA8: U21.27(A8) U22.27(A8)
M2RA9: U21.28(A9) U22.28(A9)
M2WE: U21.13(WE) U22.13(WE)
RAMD0: RN111.4 U1.2(DQ0) U21.2(DQ0)
RAMD1: RN111.3 U1.3(DQ1) U21.3(DQ1)
RAMD2: RN111.2 U1.4(DQ2) U21.4(DQ2)
RAMD3: RN111.1 U1.5(DQ3) U21.5(DQ3)
RAMD4: RN112.4 U1.7(DQ4) U21.7(DQ4)
RAMD5: RN112.3 U1.8(DQ5) U21.8(DQ5)
RAMD6: RN112.2 U1.9(DQ6) U21.9(DQ6)
RAMD7: RN112.1 U1.10(DQ7) U21.10(DQ7)
RAMD8: RN113.1 U1.33(DQ8) U21.33(DQ8)
RAMD9: RN113.2 U1.34(DQ9) U21.34(DQ9)
RAMD10: RN113.3 U1.35(DQ10) U21.35(DQ10)
RAMD11: RN113.4 U1.36(DQ11) U21.36(DQ11)
RAMD12: RN114.4 U1.38(DQ12) U21.38(DQ12)
RAMD13: RN114.3 U1.39(DQ13) U21.39(DQ13)
RAMD14: RN114.2 U1.40(DQ14) U21.40(DQ14)
RAMD15: RN114.1 U1.41(DQ15) U21.41(DQ15)
RAMD16: RN121.4 U2.2(DQ0) U22.2(DQ0)
RAMD17: RN121.3 U2.3(DQ1) U22.3(DQ1)
RAMD18: RN121.2 U2.4(DQ2) U22.4(DQ2)
RAMD19: RN121.1 U2.5(DQ3) U22.5(DQ3)
RAMD20: RN122.4 U2.7(DQ4) U22.7(DQ4)
RAMD21: RN122.3 U2.8(DQ5) U22.8(DQ5)
RAMD22: RN122.2 U2.9(DQ6) U22.9(DQ6)
RAMD23: RN122.1 U2.10(DQ7) U22.10(DQ7)
RAMD24: RN123.1 U2.33(DQ8) U22.33(DQ8)
RAMD25: RN123.2 U2.34(DQ9) U22.34(DQ9)
RAMD26: RN123.3 U2.35(DQ10) U22.35(DQ10)
RAMD27: RN123.4 U2.36(DQ11) U22.36(DQ11)
RAMD28: RN124.4 U2.38(DQ12) U22.38(DQ12)
RAMD29: RN124.3 U2.39(DQ13) U22.39(DQ13)
RAMD30: RN124.2 U2.40(DQ14) U22.40(DQ14)
RAMD31: RN124.1 U2.41(DQ15) U22.41(DQ15)

Not connected (* = marked no-connect by the designer): U1 15(A11)* 16(A10)*; U2 15(A11)* 16(A10)*; U21 15(A11)* 16(A10)*; U22 15(A11)* 16(A10)*

### Notes on the sheet
- Master RAM
- Slave RAM
- SIZE
- CODION LTD
- DIMENSIONS
- TITLE
- VARIANT
- REVISION
- DATE
- A3
- SHEET
- OF
- FILE
- DRAWN BY

### Library data of the parts
C1-C6 C21-C26 = 100nF0805: as C9 on sheet A5000_8MB_MEMCs; Datasheet Link: https://product.tdk.com/info/en/catalog/datasheets/mlcc_commercial_midvoltage_en.pdf; Height: 1.45mm; Mouser Part Number: 810-C2012X7R1H104KT5; Mouser Price/Stock: https://www.mouser.com/Search/Refine.aspx?Keyword=810-C2012X7R1H104KT5; Arrow Part Number: C2012X7R1H104K125AM; Arrow Price/Stock: https://www.arrow.com/en/products/c2012x7r1h104k125am/tdk; LCSC Part #: C111492
C7 C8 = EEE1VA470WP: as C13 on sheet A5000_8MB_MEMCs; Datasheet Link: http://industrial.panasonic.com/cdbs/www-data/pdf/RDE0000/ABA0000C1145.pdf; Height: 7.8mm; Manufacturer_Part_Number: EEE1VA470WP
RN111-RN114 RN121-RN124 = YC164-JR-0768RL: Resistor Network; Manufacturer_Name: KEMET; Datasheet Link: https://www.yageo.com/upload/media/product/productsearch/datasheet/rchip/PYu-YC_TC_group_51_RoHS_L_9.pdf; Height: 0.7mm; Manufacturer_Part_Number: YC164-JR-0768RL; Mouser Part Number: 603-YC164-JR-0768RL; Mouser Price/Stock: https://www.mouser.co.uk/ProductDetail/Yageo/YC164-JR-0768RL?qs=8cPjvKtxWv7AOp%2F0jDxI3w%3D%3D; Arrow Part Number: YC164-JR-0768RL; Arrow Price/Stock: https://www.arrow.com/en/products/yc164-jr-0768rl/yageo; LCSC Part #: C695188
U1 U2 U21 U22 = DRAM_1MX16_SOJ: Value: IS41C16105C

## Nets that join several sheets
GND: A5000_8MB_MEMCs (27 pins), A5000_8MB_Glue (14 pins), A5000_8MB_RAMs (26 pins)
VCC: A5000_8MB_MEMCs (20 pins), A5000_8MB_Glue (36 pins), A5000_8MB_RAMs (26 pins)
ABRT: A5000_8MB_MEMCs (J2.12), A5000_8MB_Glue (IC53.3)
CLK1: A5000_8MB_MEMCs (SK1.67), A5000_8MB_Glue (R8.1)
CLK2: A5000_8MB_MEMCs (SK2.67), A5000_8MB_Glue (R9.1)
CLKIN: A5000_8MB_MEMCs (J2.13), A5000_8MB_Glue (LK1.3)
D0: A5000_8MB_MEMCs (J3.C3), A5000_8MB_RAMs (RN111.7)
D1: A5000_8MB_MEMCs (J3.A3), A5000_8MB_RAMs (RN111.8)
D2: A5000_8MB_MEMCs (J3.A4), A5000_8MB_RAMs (RN111.6)
D3: A5000_8MB_MEMCs (J3.C4), A5000_8MB_RAMs (RN111.5)
D4: A5000_8MB_MEMCs (J3.A5), A5000_8MB_RAMs (RN112.8)
D5: A5000_8MB_MEMCs (J3.C5), A5000_8MB_RAMs (RN112.7)
D6: A5000_8MB_MEMCs (J3.C6), A5000_8MB_RAMs (RN112.6)
D7: A5000_8MB_MEMCs (J3.A7), A5000_8MB_RAMs (RN112.5)
D8: A5000_8MB_MEMCs (J3.A8), A5000_8MB_RAMs (RN113.7)
D9: A5000_8MB_MEMCs (J3.C7), A5000_8MB_RAMs (RN113.8)
D10: A5000_8MB_MEMCs (J3.C8), A5000_8MB_RAMs (RN113.6)
D11: A5000_8MB_MEMCs (J3.A9), A5000_8MB_RAMs (RN113.5)
D12: A5000_8MB_MEMCs (J3.A10), A5000_8MB_RAMs (RN114.7)
D13: A5000_8MB_MEMCs (J3.C9), A5000_8MB_RAMs (RN114.8)
D14: A5000_8MB_MEMCs (J3.A11), A5000_8MB_RAMs (RN114.5)
D15: A5000_8MB_MEMCs (J3.C11), A5000_8MB_RAMs (RN114.6)
D16: A5000_8MB_MEMCs (J3.C13), A5000_8MB_RAMs (RN121.7)
D17: A5000_8MB_MEMCs (J3.A13), A5000_8MB_RAMs (RN121.8)
D18: A5000_8MB_MEMCs (J3.C18), A5000_8MB_RAMs (RN121.6)
D19: A5000_8MB_MEMCs (J3.A19), A5000_8MB_RAMs (RN121.5)
D20: A5000_8MB_MEMCs (J3.A20), A5000_8MB_RAMs (RN122.7)
D21: A5000_8MB_MEMCs (J3.C19), A5000_8MB_RAMs (RN122.8)
D22: A5000_8MB_MEMCs (J3.A22), A5000_8MB_RAMs (RN122.5)
D23: A5000_8MB_MEMCs (J3.C21), A5000_8MB_RAMs (RN122.6)
D24: A5000_8MB_MEMCs (J3.C23), A5000_8MB_RAMs (RN123.6)
D25: A5000_8MB_MEMCs (J3.A23), A5000_8MB_RAMs (RN123.8)
D26: A5000_8MB_MEMCs (J3.A24), A5000_8MB_RAMs (RN123.7)
D27: A5000_8MB_MEMCs (J3.C24), A5000_8MB_RAMs (RN123.5)
D28: A5000_8MB_MEMCs (J3.A26), A5000_8MB_RAMs (RN124.8)
D29: A5000_8MB_MEMCs (J3.C25), A5000_8MB_RAMs (RN124.6)
D30: A5000_8MB_MEMCs (J3.A27), A5000_8MB_RAMs (RN124.7)
D31: A5000_8MB_MEMCs (J3.C26), A5000_8MB_RAMs (RN124.5)
FLBK: A5000_8MB_MEMCs (J2.23), A5000_8MB_Glue (IC4.6)
M1ABRT: A5000_8MB_MEMCs (SK1.53), A5000_8MB_Glue (IC53.1)
M1DBE: A5000_8MB_MEMCs (J2.6 SK1.56), A5000_8MB_Glue (IC1.1 IC1.3)
M1nCAS0: A5000_8MB_MEMCs (SK1.39), A5000_8MB_RAMs (U1.31)
M1nCAS1: A5000_8MB_MEMCs (SK1.40), A5000_8MB_RAMs (U1.30)
M1nCAS2: A5000_8MB_MEMCs (SK1.41), A5000_8MB_RAMs (U2.31)
M1nCAS3: A5000_8MB_MEMCs (SK1.42), A5000_8MB_RAMs (U2.30)
M1nRAS: A5000_8MB_MEMCs (SK1.38), A5000_8MB_RAMs (U1.14 U2.14)
M1OE: A5000_8MB_Glue (IC1.6), A5000_8MB_RAMs (U1.29 U2.29)
M1RA0: A5000_8MB_MEMCs (SK1.28), A5000_8MB_RAMs (U1.17 U2.17)
M1RA1: A5000_8MB_MEMCs (SK1.29), A5000_8MB_RAMs (U1.18 U2.18)
M1RA2: A5000_8MB_MEMCs (SK1.30), A5000_8MB_RAMs (U1.19 U2.19)
M1RA3: A5000_8MB_MEMCs (SK1.31), A5000_8MB_RAMs (U1.20 U2.20)
M1RA4: A5000_8MB_MEMCs (SK1.32), A5000_8MB_RAMs (U1.23 U2.23)
M1RA5: A5000_8MB_MEMCs (SK1.33), A5000_8MB_RAMs (U1.24 U2.24)
M1RA6: A5000_8MB_MEMCs (SK1.34), A5000_8MB_RAMs (U1.25 U2.25)
M1RA7: A5000_8MB_MEMCs (SK1.35), A5000_8MB_RAMs (U1.26 U2.26)
M1RA8: A5000_8MB_MEMCs (SK1.36), A5000_8MB_RAMs (U1.27 U2.27)
M1RA9: A5000_8MB_MEMCs (SK1.37), A5000_8MB_RAMs (U1.28 U2.28)
M1WE: A5000_8MB_Glue (IC1.2), A5000_8MB_RAMs (U1.13 U2.13)
M2ABRT: A5000_8MB_MEMCs (SK2.53), A5000_8MB_Glue (IC53.2 R3.1)
M2DBE: A5000_8MB_MEMCs (SK2.56), A5000_8MB_Glue (IC1.11 IC1.13)
M2nCAS0: A5000_8MB_MEMCs (SK2.39), A5000_8MB_RAMs (U21.31)
M2nCAS1: A5000_8MB_MEMCs (SK2.40), A5000_8MB_RAMs (U21.30)
M2nCAS2: A5000_8MB_MEMCs (SK2.41), A5000_8MB_RAMs (U22.31)
M2nCAS3: A5000_8MB_MEMCs (SK2.42), A5000_8MB_RAMs (U22.30)
M2nRAS: A5000_8MB_MEMCs (SK2.38), A5000_8MB_RAMs (U21.14 U22.14)
M2OE: A5000_8MB_Glue (IC1.8), A5000_8MB_RAMs (U21.29 U22.29)
M2RA0: A5000_8MB_MEMCs (SK2.28), A5000_8MB_RAMs (U21.17 U22.17)
M2RA1: A5000_8MB_MEMCs (SK2.29), A5000_8MB_RAMs (U21.18 U22.18)
M2RA2: A5000_8MB_MEMCs (SK2.30), A5000_8MB_RAMs (U21.19 U22.19)
M2RA3: A5000_8MB_MEMCs (SK2.31), A5000_8MB_RAMs (U21.20 U22.20)
M2RA4: A5000_8MB_MEMCs (SK2.32), A5000_8MB_RAMs (U21.23 U22.23)
M2RA5: A5000_8MB_MEMCs (SK2.33), A5000_8MB_RAMs (U21.24 U22.24)
M2RA6: A5000_8MB_MEMCs (SK2.34), A5000_8MB_RAMs (U21.25 U22.25)
M2RA7: A5000_8MB_MEMCs (SK2.35), A5000_8MB_RAMs (U21.26 U22.26)
M2RA8: A5000_8MB_MEMCs (SK2.36), A5000_8MB_RAMs (U21.27 U22.27)
M2RA9: A5000_8MB_MEMCs (SK2.37), A5000_8MB_RAMs (U21.28 U22.28)
M2WE: A5000_8MB_Glue (IC1.12), A5000_8MB_RAMs (U21.13 U22.13)
MFLBK: A5000_8MB_MEMCs (SK1.45 SK2.45), A5000_8MB_Glue (IC4.7)
MnBW: A5000_8MB_MEMCs (SK2.63), A5000_8MB_Glue (R1.1)
MnSDRQ: A5000_8MB_MEMCs (SK1.47 SK2.47), A5000_8MB_Glue (IC4.5)
MnVDRQ: A5000_8MB_MEMCs (SK1.48 SK2.48), A5000_8MB_Glue (IC4.2)
MRST: A5000_8MB_MEMCs (SK1.44 SK2.44), A5000_8MB_Glue (IC4.12 IC52.1 IC71.8)
MRST_IN: A5000_8MB_MEMCs (J2.25), A5000_8MB_Glue (IC4.14)
nBW: A5000_8MB_MEMCs (J2.1 SK1.63), A5000_8MB_Glue (IC53.5)
nSDRQ: A5000_8MB_MEMCs (J2.24), A5000_8MB_Glue (IC4.4)
nVDRQ: A5000_8MB_MEMCs (J2.22), A5000_8MB_Glue (IC4.3)
RCLK: A5000_8MB_MEMCs (J2.3 SK1.64), A5000_8MB_Glue (R2.2)
REF2: A5000_8MB_MEMCs (SK2.64), A5000_8MB_Glue (IC71.3 R10.1)

## Assembly variants
JLCPCB_Assy: not fitted C1 C2 C3 C4 C5 C6 C7 C8 C13 C16 C21 C22 C23 C24 C25 C26 C30 C101 IC53 IC71 J1 J2 J3 LK1 RST_OUT SK1 SK2 U1 U2 U21 U22 Y1 Y2